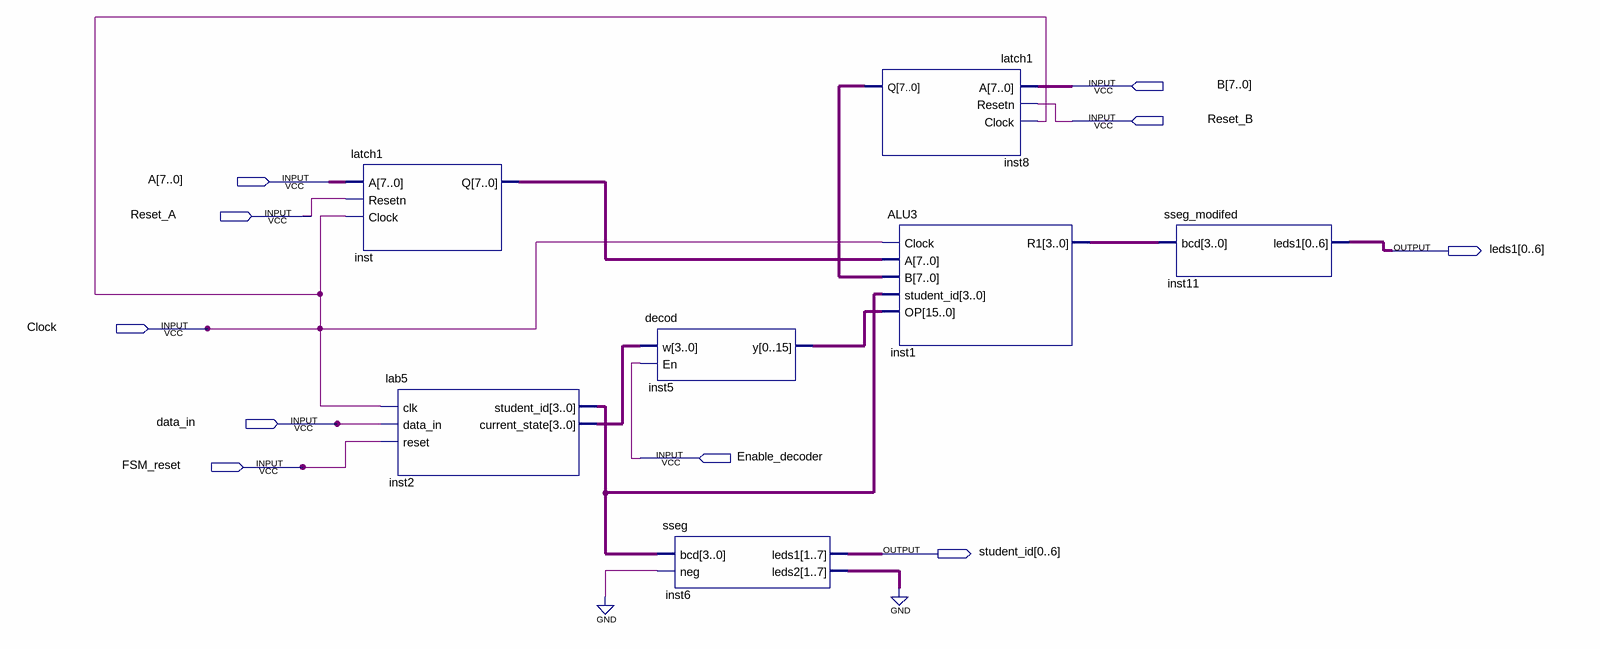
[diagram p0: schematic sheet]
// Quartus schematic Problem3_Block.bdf as structural Verilog: 7 symbols, 10 pins
module Problem3_Block (
  input  [7:0] B,
  input  Reset_B,
  input  [7:0] A,
  input  Reset_A,
  input  Clock,
  input  data_in,
  input  Enable_decoder,
  input  FSM_reset,
  output [0:6] leds1,
  output [0:6] student_id
);

  wire [3:0] inst1_r1, inst2_current_state, inst2_student_id;
  wire [6:0] inst6_leds2;
  wire [7:0] inst8_q, inst_q;
  wire [15:0] inst5_y;

  latch1 inst (.A(A), .Resetn(Reset_A), .Clock(Clock), .Q(inst_q));
  lab5 inst2 (
    .clk(Clock), .data_in(data_in), .reset(FSM_reset), .student_id(inst2_student_id),
    .current_state(inst2_current_state));
  decod inst5 (.w(inst2_current_state), .En(Enable_decoder), .y(inst5_y));
  sseg inst6 (.bcd(inst2_student_id), .neg(1'b0), .leds1(student_id), .leds2(inst6_leds2));
  latch1 inst8 (.A(B), .Resetn(Reset_B), .Clock(Clock), .Q(inst8_q));
  ALU3 inst1 (.Clock(Clock), .A(inst_q), .B(inst8_q), .student_id(inst2_student_id), .OP(inst5_y), .R1(inst1_r1));
  sseg_modifed inst11 (.bcd(inst1_r1), .leds1(leds1));
  // also tied to GND on the sheet: {inst6_leds2[0], inst6_leds2[1], inst6_leds2[2], inst6_leds2[3], inst6_leds2[4], inst6_leds2[5], inst6_leds2[6]}
endmodule
